# EAGLE design User Port (EAGLE 9.5.2)
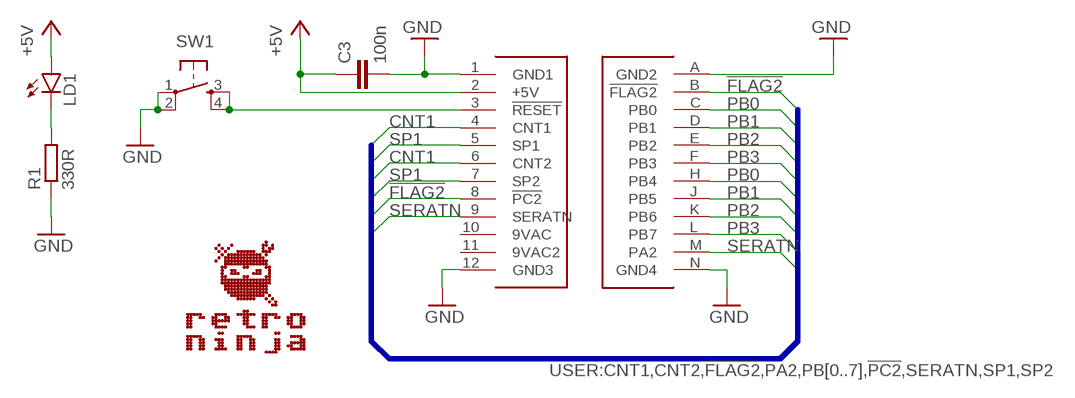
[diagram p0: schematic, sheet 1]

## Parts
C3  100n  C-EUC0805  [C0805]
LD1  LED3MM  [LED3MM]
R1  330R  R-EU_R0805  [R0805]
SW1  TAC_SWITCHPTH  [TACTILE-PTH]
U$1  RETRONINJA_TEXT  [RETRONINJA_TEXT_17MM]
X1  C64_USER_PORT_CONNECTOR_SIDE  [C64_USER_PORT_DEVICE_CONNECTOR]

## Nets
!FLAG2: X1.8(!PC2) X1.B(!FLAG2)
!RESET: SW1.3 SW1.4 X1.3(!RESET)
+5V: C3.1 LD1.A X1.2(+5V)
CNT1: X1.4(CNT1) X1.6(CNT2)
GND: C3.2 R1.1 SW1.1 SW1.2 X1.1(GND1) X1.12(GND3) X1.A(GND2) X1.N(GND4)
N$2: LD1.K(C) R1.2
PB0: X1.C(PB0) X1.H(PB4)
PB1: X1.D(PB1) X1.J(PB5)
PB2: X1.E(PB2) X1.K(PB6)
PB3: X1.F(PB3) X1.L(PB7)
SERATN: X1.9(SERATN) X1.M(PA2)
SP1: X1.5(SP1) X1.7(SP2)

## Buses
USER:CNT1,CNT2,!FLAG2,PA2,PB[0..7],!PC2,SERATN,SP1,SP2

## Power pins joined to a net without a drawn wire
9VAC: X1.10(9VAC)
9VAC2: X1.11(9VAC2)

## Library data of the parts
C3 = rcl:C-EU: CAPACITOR, European symbol; SPICEPREFIX: C
LD1 = led:LED: LED OSRAM: - CHIPLED LG R971, LG N971, LY N971, LG Q971, LY Q971, LO R971, LY R971 LH N974, LH R974 LS Q976, LO Q976, LY Q976 LO Q996 - Hyper CHIPLED LW Q18S LB Q993, LB Q99A, LB R99A - SideLED LS A670, LO A670, LY A670, LG A670, LP A670 LB A673, LV A673, LT A673, LW A673 LH A674 LY A675 LS A676, LA A676, LO A676, LY A676, LW A676 LS A679, LY A679, LG A679 - Hyper Micro SIDELED® LS Y876, LA Y876, LO Y876, LY Y876 LT Y87S - SmartLED LW L88C, LW L88S LB L89C, LB L89S, LG L890 LS L89K, LO L89K, LY L89K LS L896, LA L896, LO L896, LY L896 - TOPLED LS T670, LO T670, LY T670, LG T670, LP T670 LSG T670, LSP T670, LSY T670, LOP T670, LYG T670 LG T671, LOG T671, LSG T671 LB T673, LV T673, LT T673, LW T673 LH T674 LS T676, LA T676, LO T676, LY T676, LB T676, LH T676, LSB T676, LW T676 LB T67C, LV T67C, LT T67C, LS T67K, LO T67K, LY T67K, LW E67C LS E67B, LA E67B, LO E67B, LY E67B, LB E67C, LV E67C, LT E67C LW T67C LS T679, LY T679, LG T679 LS T770, LO T770, LY T770, LG T770, LP T770 LB T773, LV T773, LT T773, LW T773 LH T774 LS E675, LA E675, LY E675, LS T675 LS T776, LA T776, LO T776, LY T776, LB T776 LHGB T686 LT T68C, LB T68C - Hyper Mini TOPLED® LB M676 - Mini TOPLED Santana® LG M470 LS M47K, LO M47K, LY M47K Source: http://www.osram.convergy.de LUXEON: - LUMILED® LXK2-PW12-R00, LXK2-PW12-S00, LXK2-PW14-U00, LXK2-PW14-V00 LXK2-PM12-R00, LXK2-PM12-S00, LXK2-PM14-U00 LXK2-PE12-Q00, LXK2-PE12-R00, LXK2-PE12-S00, LXK2-PE14-T00, LXK2-PE14-U00 LXK2-PB12-K00, LXK2-PB12-L00, LXK2-PB12-M00, LXK2-PB14-N00, LXK2-PB14-P00, LXK2-PB14-Q00 LXK2-PR12-L00, LXK2-PR12-M00, LXK2-PR14-Q00, LXK2-PR14-R00 LXK2-PD12-Q00, LXK2-PD12-R00, LXK2-PD12-S00 LXK2-PH12-R00, LXK2-PH12-S00 LXK2-PL12-P00, LXK2-PL12-Q00, LXK2-PL12-R00 Source: www.luxeon.com KINGBRIGHT: KA-3528ASYC Source: www.kingbright.com
R1 = rcl:R-EU_: RESISTOR, European symbol; SPICEPREFIX: R
SW1 = SparkFun-Electromechanical:TAC_SWITCH: Momentary Switch Button commonly used for reset or general input. Spark Fun Electronics SKU : COM-00097 SMT- SWCH-08247
U$1 = PCBGraphics:RETRONINJA_TEXT
X1 = Per:C64_USER_PORT

## Board
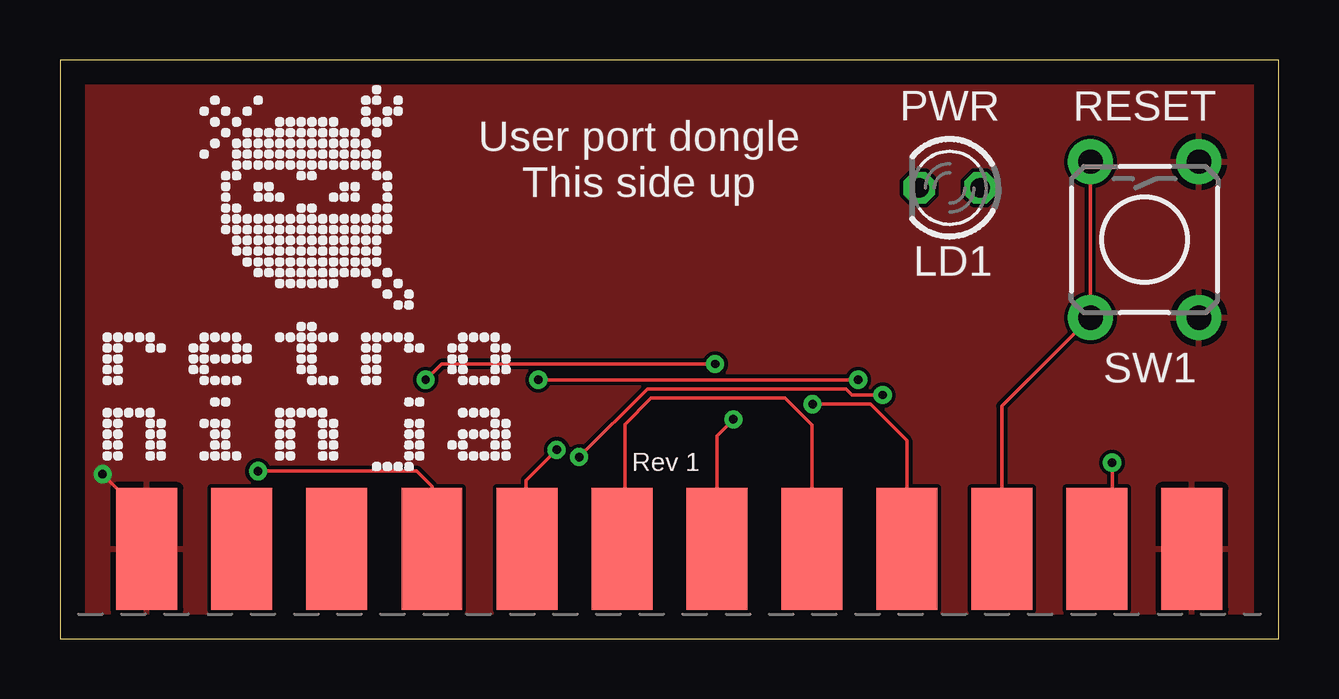
[diagram p1: board, top side]
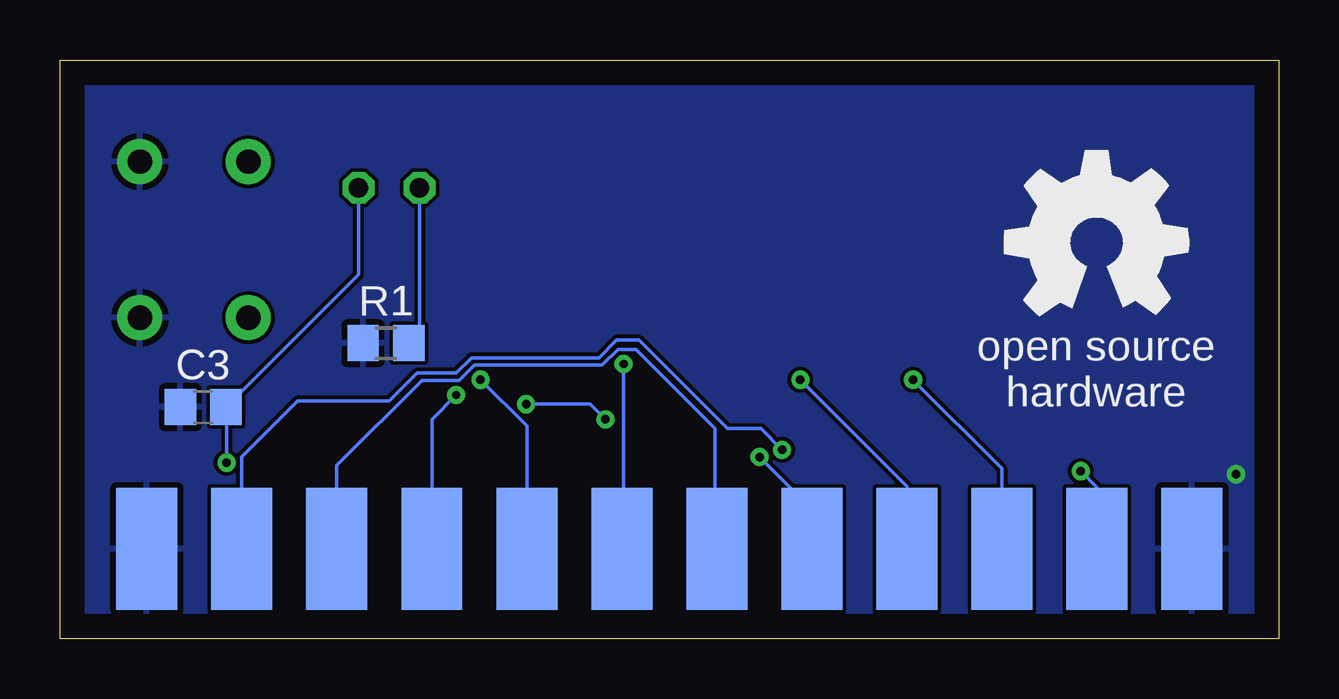
[diagram p2: board, bottom side, seen from below]

Size 50.8 x 24.13 mm. Coordinates in mm from the lower left corner, seen from the top.
Outline: 0,0 50.8,0 50.8,24.13 0,24.13 0,0
Copper layers (1*16): Top 0.035mm / dielectric 0.15mm / Bottom 0.035mm
Design rules "default": minimum track width 6mil, minimum drill 0.35mm, track to track 6mil, track to pad 6mil, pad to pad 6mil, via to via 6mil, smd to smd 6mil, copper to edge 40mil, drill to drill 6mil, minimum pad ring 10mil, minimum via ring 8mil, stop-mask expansion 4mil, vias tented up to drill 0mil, thermal gap 10mil

### Footprints (pad centres in the part's own frame; a part is rotated, then mirrored left to right if it is on the bottom)
C0805 = smd 1.3 x 1.5: 1 -0.95,0; 2 0.95,0
LED3MM = drill 0.813 octagon: A -1.27,0; K 1.27,0
R0805 = smd 1.3 x 1.5: 1 -0.95,0; 2 0.95,0
TACTILE-PTH = drill 1.016 pad 1.88: 1 -3.251,2.261; 2 3.251,2.261; 3 -3.251,-2.261; 4 3.251,-2.261
C64_USER_PORT_DEVICE_CONNECTOR = smd 2.54 x 5.08: 1 21.78,2.73; 2 17.82,2.73; 3 13.86,2.73; 4 9.9,2.73; 5 5.94,2.73; 6 1.98,2.73; 7 -1.98,2.73; 8 -5.94,2.73; 9 -9.9,2.73; 10 -13.86,2.73; 11 -17.82,2.73; 12 -21.78,2.73 | smd 2.54 x 5.08 bottom: A 21.78,2.73; B 17.82,2.73; C 13.86,2.73; D 9.9,2.73; E 5.94,2.73; F 1.98,2.73; H -1.98,2.73; J -5.94,2.73; K -9.9,2.73; L -13.86,2.73; M -17.82,2.73; N -21.78,2.73

### Placement (x,y rotation side)
C3  44.83,9.65 180 bottom
LD1  37.08,18.8 180 top
R1  37.21,12.32 0 bottom
SW1  45.21,16.64 270 top
U$1  10.29,13.84 0 top
U$2  [OSHW_8MM]  7.62,16.51 0 bottom
X1  25.4,1.02 0 top

### Tracks (layer width: path | path; a pad name or v marks a point on that pad's centre or on a via)
!FLAG2  (via drill 0.35)
  Top 0.152: v20.7,7.87 19.43,6.6 19.43,3.77 X1.8
  Bottom 0.152: X1.B 43.22,7.58 40.89,9.91 37.08,9.91 35.92,11.07 34.29,11.07 33.65,11.71 28.34,11.71 27.6,12.45 26.67,12.45 22.99,8.76 21.59,8.76 v20.7,7.87
!RESET
  Top 0.152: X1.3 39.26,9.69 SW1.4 SW1.3
+5V  (via drill 0.35)
  Top 0.152: v43.85,7.34 43.85,4.38 X1.2
  Bottom 0.152: LD1.A 38.35,15.18 C3.1 43.85,9.63 v43.85,7.34
CNT1  (via drill 0.35)
  Top 0.152: X1.6 27.38,8.46 v28.07,9.14 | v31.37,9.78 33.78,9.78 35.3,8.26 X1.4
  Bottom 0.152: v31.37,9.78 28.7,9.78 v28.07,9.14
GND  (via drill 0.35)
  Top 0.152: X1.N 3.62,5.02 v1.78,6.86
  pour Bottom: 0,0 0,24.13 50.8,24.13 50.8,0
  pour Top: 0,0 0,24.13 50.8,24.13 50.8,0
N$2
  Bottom 0.152: R1.2 35.81,12.77 LD1.K
PB0
  Bottom 0.152: X1.C 39.26,7.22 35.72,10.77 34.16,10.77 33.52,11.4 28.21,11.4 27.55,12.06 26.8,12.06 23.5,8.76 23.5,5.09 X1.H
PB1  (via drill 0.35)
  Top 0.152: v34.29,10.16 33.02,10.16 32.77,10.41 24.48,10.41 v21.64,7.57
  Bottom 0.152: X1.D 35.3,9.15 v34.29,10.16 | v21.64,7.57 19.46,5.39 X1.J
PB2  (via drill 0.35)
  Top 0.152: v33.27,10.79 v19.94,10.79
  Bottom 0.152: X1.E 31.34,8.86 v33.27,10.79 | v19.94,10.79 15.5,6.36 X1.K
PB3  (via drill 0.35)
  Top 0.152: v27.3,11.45 15.9,11.45 v15.24,10.79
  Bottom 0.152: X1.F 27.3,5.09 v27.3,11.45 | X1.L 11.54,7.09 v15.24,10.79
SERATN  (via drill 0.35)
  Top 0.152: v8.26,6.99 14.87,6.99 15.5,6.35 X1.9
  Bottom 0.152: X1.M 7.58,6.31 v8.26,6.99
SP1
  Top 0.152: X1.5 31.34,8.92 30.23,10.03 24.64,10.03 23.55,8.94 23.55,5.14 X1.7

### Text on the board
tPlace: PWR | RESET | User port dongle / This side up | Rev 1